# EAGLE design LDR based circuit (EAGLE 7.2.0)
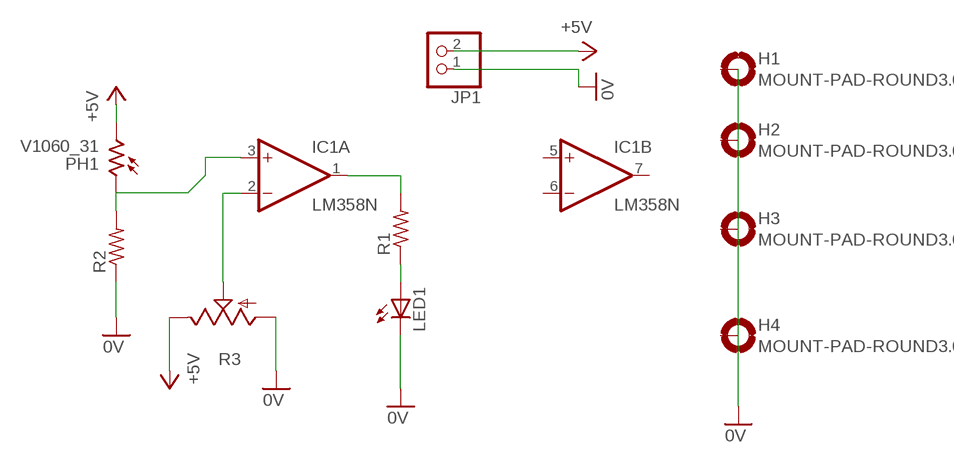
[diagram p0: schematic, sheet 1]

## Parts
H1  MOUNT-PAD-ROUND3.0  [3,0-PAD]
H2  MOUNT-PAD-ROUND3.0  [3,0-PAD]
H3  MOUNT-PAD-ROUND3.0  [3,0-PAD]
H4  MOUNT-PAD-ROUND3.0  [3,0-PAD]
IC1  LM358N  [DIL08]
JP1  PINHD-1X2  [1X02]
LED1  LED5MM  [LED5MM]
PH1  V1060_31  [TO-5_V10]
R1  R-US_0207/10  [0207/10]
R2  R-US_0207/10  [0207/10]
R3  TRIM_US-B25P  [B25P]

## Nets
0V: JP1.1 LED1.K(C) R2.1 R3.A
+5V: JP1.2 PH1.2 R3.E
N$1: IC1.3(A:+IN) PH1.1 R2.2
N$2: IC1.1(A:OUT) R1.2
N$3: LED1.A R1.1
N$5: IC1.2(A:-IN) R3.S
Unconnected: H1.B3,0(MOUNT) H2.B3,0(MOUNT) H3.B3,0(MOUNT) H4.B3,0(MOUNT) IC1.5(B:+IN) IC1.6(B:-IN) IC1.7(B:OUT)

## Power pins joined to a net without a drawn wire
V+: IC1.8(P:V+)
V-: IC1.4(P:V-)

## Library data of the parts
H1-H4 = holes:MOUNT-PAD-ROUND: MOUNTING PAD, round
IC1 = linear:LM358: OP AMP also LM158; LM258; LM2904 Source: http://cache.national.com/ds/LM/LM158.pdf
JP1 = pinhead:PINHD-1X2: PIN HEADER
LED1 = led:LED: LED OSRAM: - CHIPLED LG R971, LG N971, LY N971, LG Q971, LY Q971, LO R971, LY R971 LH N974, LH R974 LS Q976, LO Q976, LY Q976 LO Q996 - Hyper CHIPLED LW Q18S LB Q993, LB Q99A, LB R99A - SideLED LS A670, LO A670, LY A670, LG A670, LP A670 LB A673, LV A673, LT A673, LW A673 LH A674 LY A675 LS A676, LA A676, LO A676, LY A676, LW A676 LS A679, LY A679, LG A679 - Hyper Micro SIDELED® LS Y876, LA Y876, LO Y876, LY Y876 LT Y87S - SmartLED LW L88C, LW L88S LB L89C, LB L89S, LG L890 LS L89K, LO L89K, LY L89K LS L896, LA L896, LO L896, LY L896 - TOPLED LS T670, LO T670, LY T670, LG T670, LP T670 LSG T670, LSP T670, LSY T670, LOP T670, LYG T670 LG T671, LOG T671, LSG T671 LB T673, LV T673, LT T673, LW T673 LH T674 LS T676, LA T676, LO T676, LY T676, LB T676, LH T676, LSB T676, LW T676 LB T67C, LV T67C, LT T67C, LS T67K, LO T67K, LY T67K, LW E67C LS E67B, LA E67B, LO E67B, LY E67B, LB E67C, LV E67C, LT E67C LW T67C LS T679, LY T679, LG T679 LS T770, LO T770, LY T770, LG T770, LP T770 LB T773, LV T773, LT T773, LW T773 LH T774 LS E675, LA E675, LY E675, LS T675 LS T776, LA T776, LO T776, LY T776, LB T776 LHGB T686 LT T68C, LB T68C - Hyper Mini TOPLED® LB M676 - Mini TOPLED Santana® LG M470 LS M47K, LO M47K, LY M47K Source: http://www.osram.convergy.de LUXEON: - LUMILED® LXK2-PW12-R00, LXK2-PW12-S00, LXK2-PW14-U00, LXK2-PW14-V00 LXK2-PM12-R00, LXK2-PM12-S00, LXK2-PM14-U00 LXK2-PE12-Q00, LXK2-PE12-R00, LXK2-PE12-S00, LXK2-PE14-T00, LXK2-PE14-U00 LXK2-PB12-K00, LXK2-PB12-L00, LXK2-PB12-M00, LXK2-PB14-N00, LXK2-PB14-P00, LXK2-PB14-Q00 LXK2-PR12-L00, LXK2-PR12-M00, LXK2-PR14-Q00, LXK2-PR14-R00 LXK2-PD12-Q00, LXK2-PD12-R00, LXK2-PD12-S00 LXK2-PH12-R00, LXK2-PH12-S00 LXK2-PL12-P00, LXK2-PL12-Q00, LXK2-PL12-R00 Source: www.luxeon.com KINGBRIGHT: KA-3528ASYC Source: www.kingbright.com
PH1 = photo-elements:?1060*: Sensor Street Light control Source: http://optoelectronics.perkinelmer.com/content/Datasheets/DTS_PhotocellsB1060.pdf
R1 R2 = rcl:R-US_: RESISTOR, American symbol
R3 = pot:TRIM_US-: POTENTIOMETER

## Board
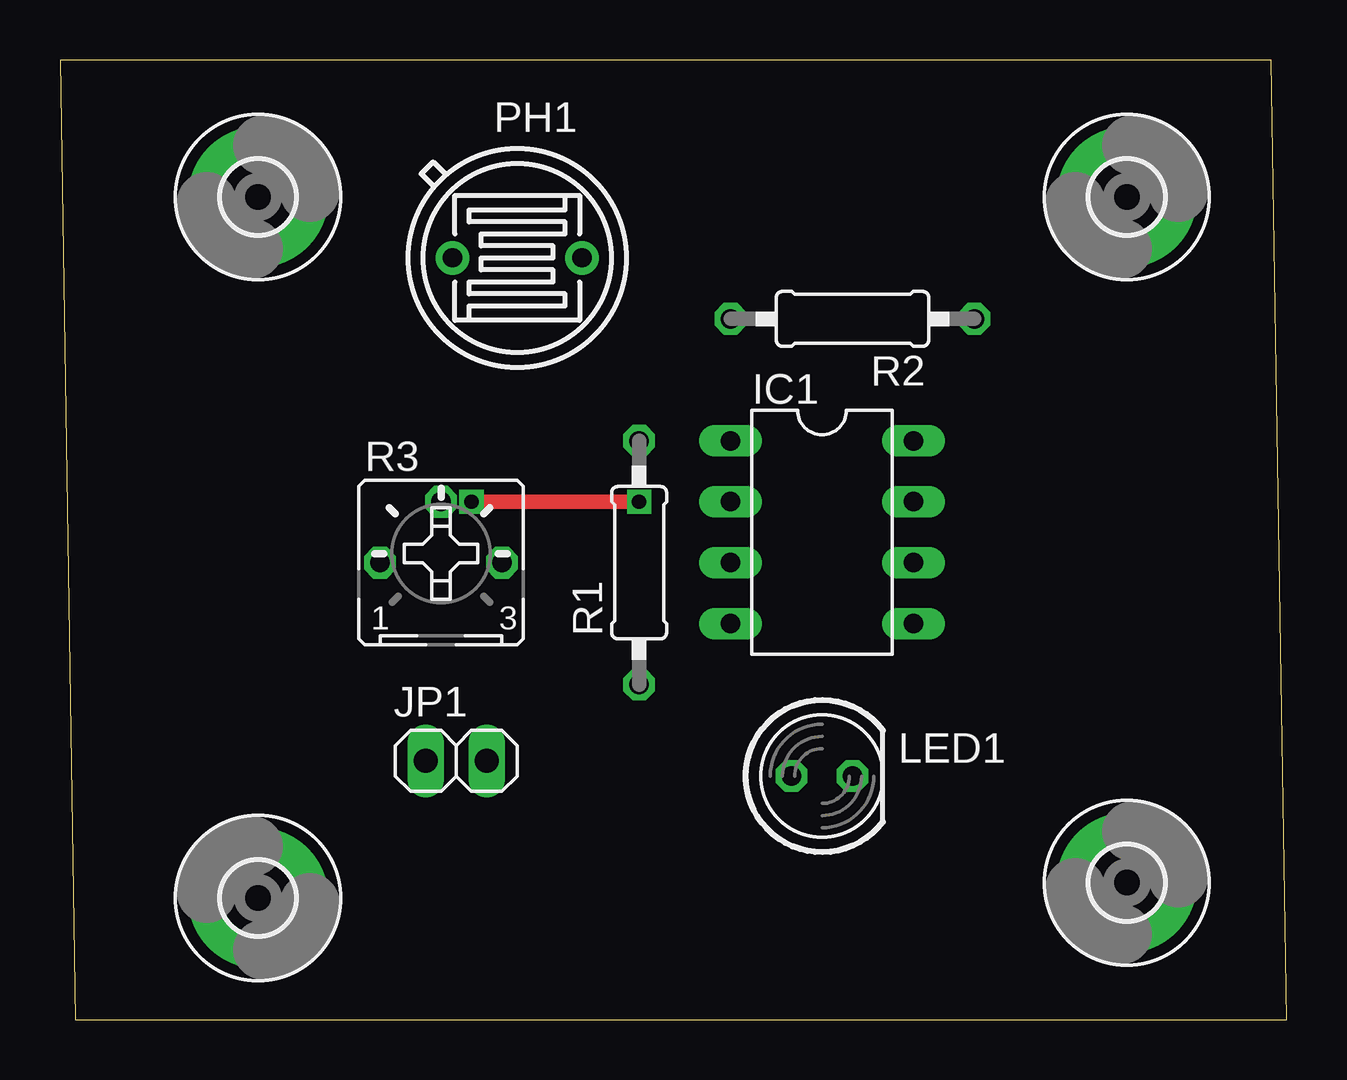
[diagram p1: board, top side]
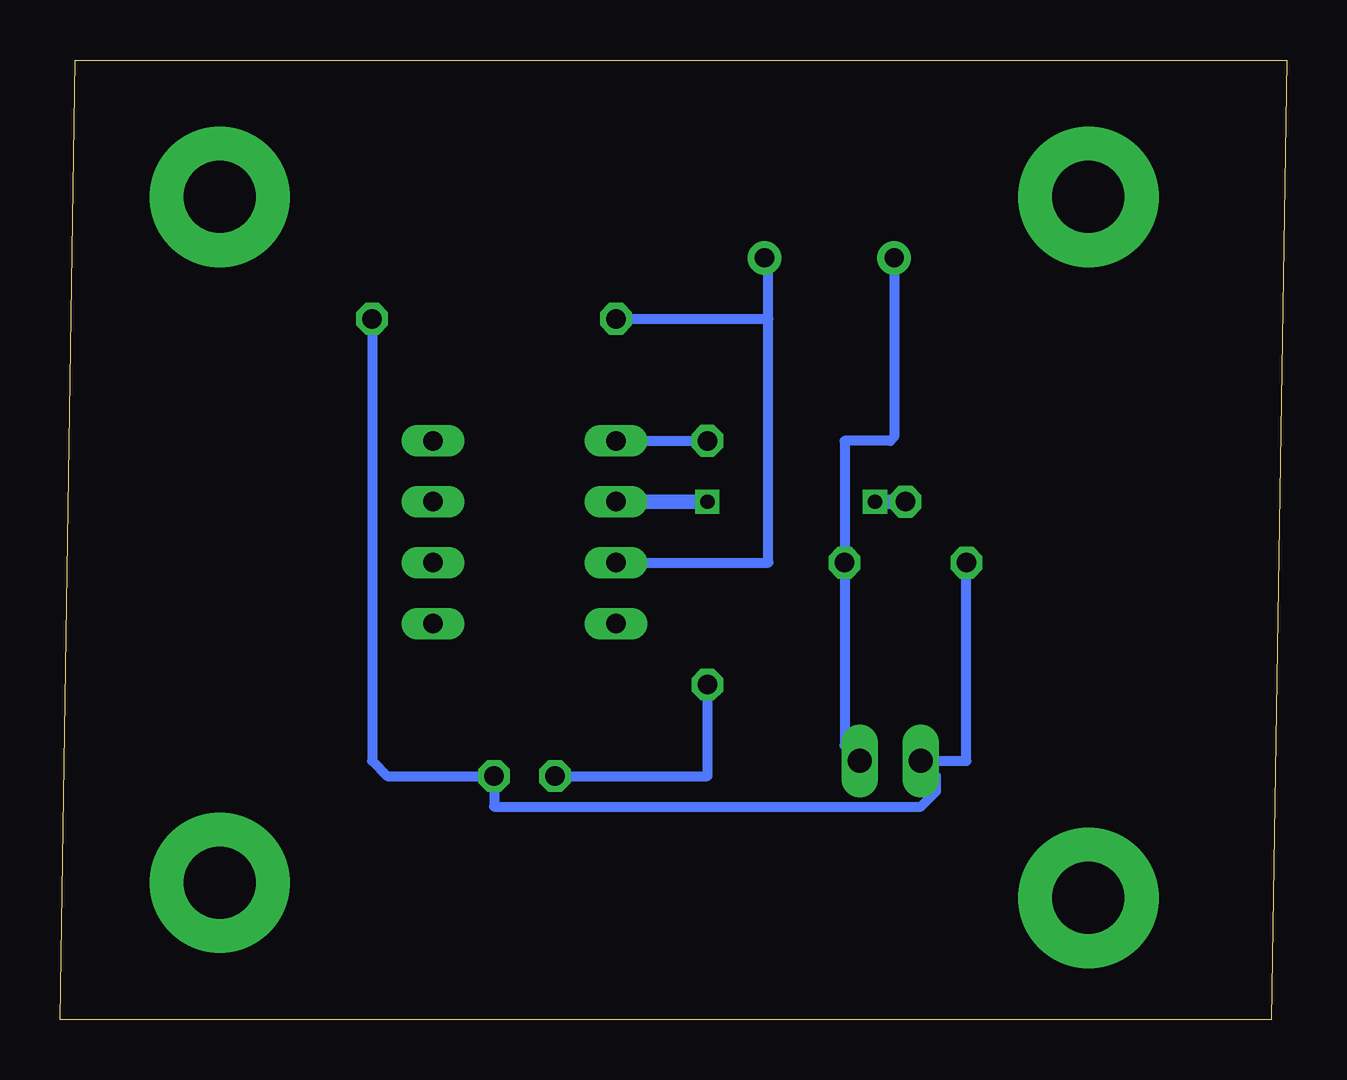
[diagram p2: board, bottom side, seen from below]

Size 51.11 x 39.99 mm. Coordinates in mm from the lower left corner, seen from the top.
Outline: 0.64,0 51.11,0 50.47,39.99 0,39.99 0.64,0
Outline: 0.64,0.64 0.64,0
Copper layers (1*16): Top 0.035mm / dielectric 1.5mm / Bottom 0.035mm
Design rules "default": minimum track width 10mil, minimum drill 24mil, track to track 8mil, track to pad 8mil, pad to pad 8mil, via to via 8mil, smd to smd 8mil, copper to edge 40mil, drill to drill 8mil, minimum pad ring 10mil, minimum via ring 8mil, stop-mask expansion 4mil, vias tented up to drill 0mil, thermal gap 10mil

### Footprints (pad centres in the part's own frame; a part is rotated, then mirrored left to right if it is on the bottom)
3,0-PAD = drill 3 pad 5.842: B3,0 0,0
DIL08 = drill 0.813 long: 1 -3.81,-3.81; 2 -1.27,-3.81; 3 1.27,-3.81; 4 3.81,-3.81; 5 3.81,3.81; 6 1.27,3.81; 7 -1.27,3.81; 8 -3.81,3.81
1X02 = drill 1.016 long: 1 -1.27,0; 2 1.27,0
LED5MM = drill 0.813 octagon: A -1.27,0; K 1.27,0
TO-5_V10 = drill 0.8 pad 1.4: 1 -2.7,0; 2 2.7,0
0207/10 = drill 0.813 octagon: 1 -5.08,0; 2 5.08,0
B25P = drill 0.813 octagon: A -2.54,0; E 2.54,0; S 0,2.54

### Placement (x,y rotation side)
H1  8.26,34.29 0 top
H2  8.26,5.08 270 top
H3  44.45,34.29 0 top
H4  44.45,5.71 0 top
IC1  31.75,20.32 270 top
JP1  16.51,10.79 0 top
LED1  31.75,10.16 0 top
PH1  19.05,31.75 180 top
R1  24.13,19.05 90 top
R2  33.02,29.21 180 top
R3  15.88,19.05 0 top

### Tracks (layer width: path | path; a pad name or v marks a point on that pad's centre or on a via)
0V
  Bottom 0.406: R2.1 38.1,10.79 37.47,10.16 LED1.K 33.02,8.89 15.24,8.89 14.61,9.53 14.61,10.16 JP1.1 13.33,10.79 R3.A
+5V
  Bottom 0.406: JP1.2 18.41,11.43 R3.E 18.41,24.13 16.51,24.13 16.35,24.29 PH1.2
N$1
  Bottom 0.406: IC1.3 21.59,19.05 21.59,29.21 | 21.59,29.21 21.59,31.59 PH1.1 | R2.2 21.59,29.21
N$2
  Bottom 0.406: IC1.1 R1.2
N$3
  Bottom 0.406: LED1.A 24.13,10.16 R1.1
N$5  (via drill 0.6)
  Top 0.61: v17.14,21.59 v24.13,21.59
  Bottom 0.61: R3.S v17.14,21.59 | v24.13,21.59 IC1.2